# Altium project DIGITAL_CLOCK.PrjPcb
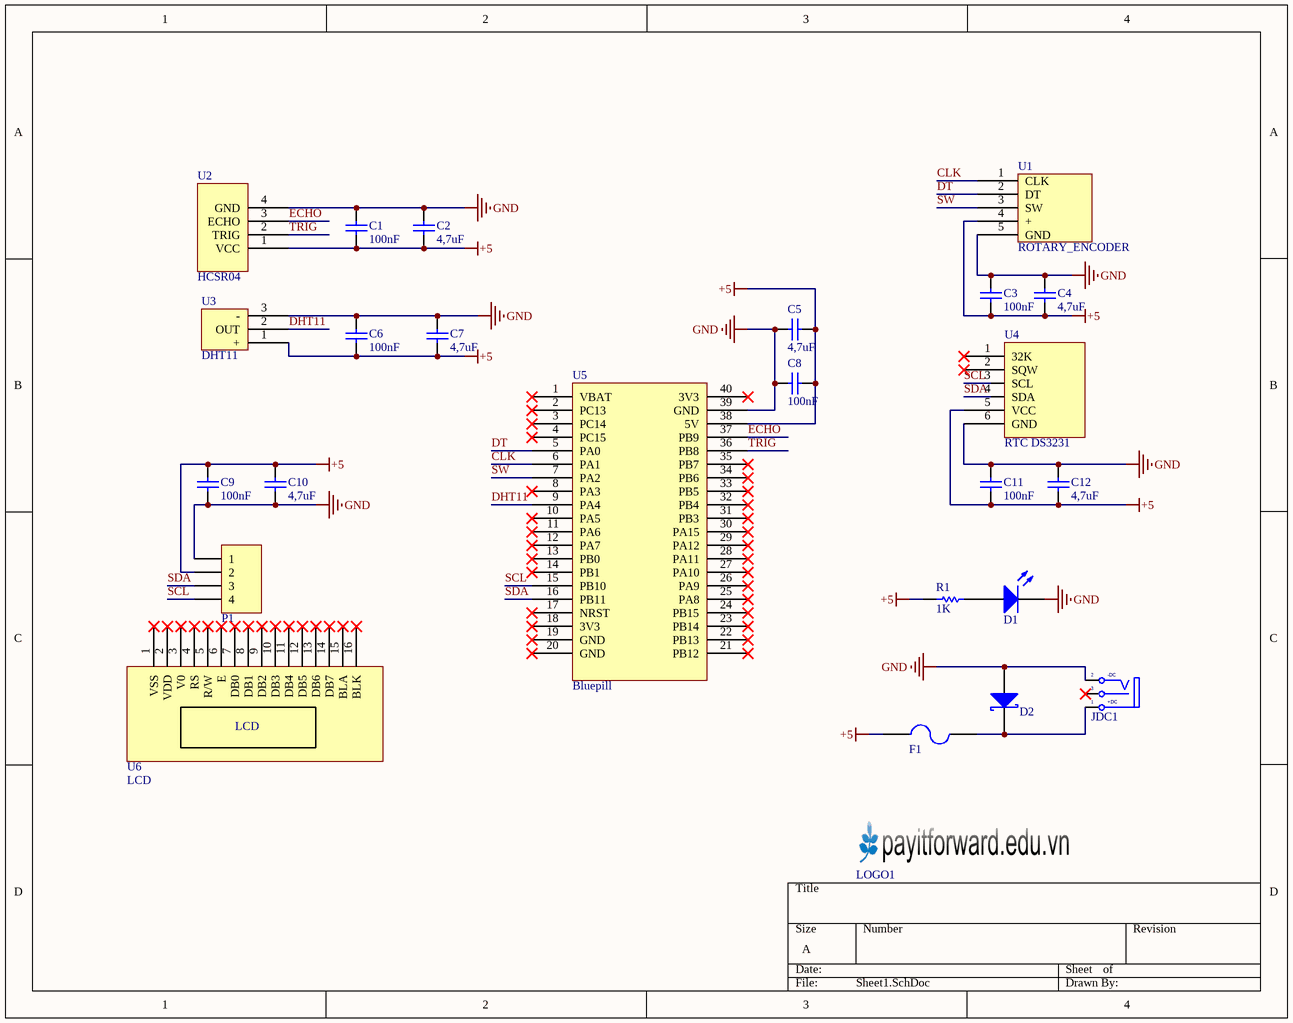
[diagram p0: Sheet1.SchDoc]
1 sheet, 25 parts. Net scope: global (net labels, ports and power ports of the same name join across sheets).
Board files: PCB1.PcbDoc, PCB2.PcbDoc

## Sheet Sheet1.SchDoc
size A; SheetNumber: 1; SheetTotal: 1

### Parts
C1  value 100nF  [CAP-SM-0805]  (hidden comment: Cap Non-Pol SMD)
C2  value 4,7uF  [CAP-SM-0805]  (hidden comment: Cap Non-Pol SMD)
C3  value 100nF  [CAP-SM-0805]  (hidden comment: Cap Non-Pol SMD)
C4  value 4,7uF  [CAP-SM-0805]  (hidden comment: Cap Non-Pol SMD)
C5  value 4,7uF  [CAP-SM-0805]  (hidden comment: Cap Non-Pol SMD)
C6  value 100nF  [CAP-SM-0805]  (hidden comment: Cap Non-Pol SMD)
C7  value 4,7uF  [CAP-SM-0805]  (hidden comment: Cap Non-Pol SMD)
C8  value 100nF  [CAP-SM-0805]  (hidden comment: Cap Non-Pol SMD)
C9  value 100nF  [CAP-SM-0805]  (hidden comment: Cap Non-Pol SMD)
C10  value 4,7uF  [CAP-SM-0805]  (hidden comment: Cap Non-Pol SMD)
C11  value 100nF  [CAP-SM-0805]  (hidden comment: Cap Non-Pol SMD)
C12  value 4,7uF  [CAP-SM-0805]  (hidden comment: Cap Non-Pol SMD)
D1  LED  [LED-3mm]  (value not drawn)
D2  D Schottky  [SS34]  (value not drawn)
F1  Fuse  [FUSE SMD]  (value not drawn)
JDC1  Jack DC  [DC-IN]  (value not drawn)
LOGO1  LOGO PIF  [PIF LOGO BIG TOP]  (value not drawn)
P1  Header 4H  [JP4H]  (value not drawn)
R1  value 1K  [RES-SM-0805]  (hidden comment: RESISTOR SMD)
U1  ROTARY_ENCODER  [ROTARY_ENCODER]
U2  HCSR04  [HCSR04]
U3  DHT11  [DHT11]
U4  RTC DS3231  [RTC_DS3231]
U5  Bluepill  [STM32F103C8T6]
U6  LCD  [LCD 2004]

### Nets
+5: C1.1 C2.1 C3.2 C4.2 C5.1 C6.1 C7.1 C8.1 C9.2 C10.2 C11.2 C12.2 F1.1 P1.2 R1.1 U1.4(+) U2.1(VCC) U3.1(+) U4.5(VCC) U5.38(5V)
GND: C1.2 C2.2 C3.1 C4.1 C5.2 C6.2 C7.2 C8.2 C9.1 C10.1 C11.1 C12.1 D1.2(K) D2.1(A) JDC1.2(TN) P1.1 U1.5(GND) U2.4(GND) U3.3(-) U4.6(GND) U5.39(GND)
CLK: U1.1(CLK) U5.6(PA1)
DHT11: U3.2(OUT) U5.9(PA4)
DT: U1.2(DT) U5.5(PA0)
ECHO: U2.3(ECHO) U5.37(PB9)
SCL: P1.4 U4.3(SCL) U5.15(PB10)
SDA: P1.3 U4.4(SDA) U5.16(PB11)
SW: U1.3(SW) U5.7(PA2)
TRIG: U2.2(TRIG) U5.36(PB8)
NetD1_1: D1.1(A) R1.2
NetD2_2: D2.2(K) F1.2 JDC1.1(T)

Not connected (* = marked no-connect by the designer): JDC1 3(S)*; U4 1(32K)* 2(SQW)*; U5 1(VBAT)* 2(PC13)* 3(PC14)* 4(PC15)* 8(PA3)* 10(PA5)* 11(PA6)* 12(PA7)* 13(PB0)* 14(PB1)* 17(NRST)* 18(3V3)* 19(GND)* 20(GND)* 21(PB12)* 22(PB13)* 23(PB14)* 24(PB15)* 25(PA8)* 26(PA9)* 27(PA10)* 28(PA11)* 29(PA12)* 30(PA15)* 31(PB3)* 32(PB4)* 33(PB5)* 34(PB6)* 35(PB7)* 40(3V3)*; U6 1(VSS)* 2(VDD)* 3(V0)* 4(RS)* 5(R/W)* 6(E)* 7(DB0)* 8(DB1)* 9(DB2)* 10(DB3)* 11(DB4)* 12(DB5)* 13(DB6)* 14(DB7)* 15(BLA)* 16(BLK)*

### Notes on the sheet
- (in symbol Jack DC) -DC; +DC

### Library data of the parts
C1-C12 = Cap Non-Pol SMD: Capacitor
D2 = D Schottky: Schottky Diode; Published: 8-Jun-2000; LatestRevisionDate: 17-Jul-2002; LatestRevisionNote: Re-released for DXP Platform.; PackageReference: SMB; Publisher: Altium Limited; PackageDescription: DO-214-AA/SMB; 2 C-Bend Leads; Body 5.3 x 3.6 mm, inc. leads (LxW); Code_JEDEC: DO-214-AA
JDC1 = Jack DC: Jack DC input; Value: Jac DC
P1 = Header 4H: Header, 4-Pin, Right Angle; LatestRevisionDate: 17-Jul-2002; LatestRevisionNote: Re-released for DXP Platform.; Publisher: Altium Limited
R1 = RESISTOR SMD: Resistor
U5 = STM32F103C8T6